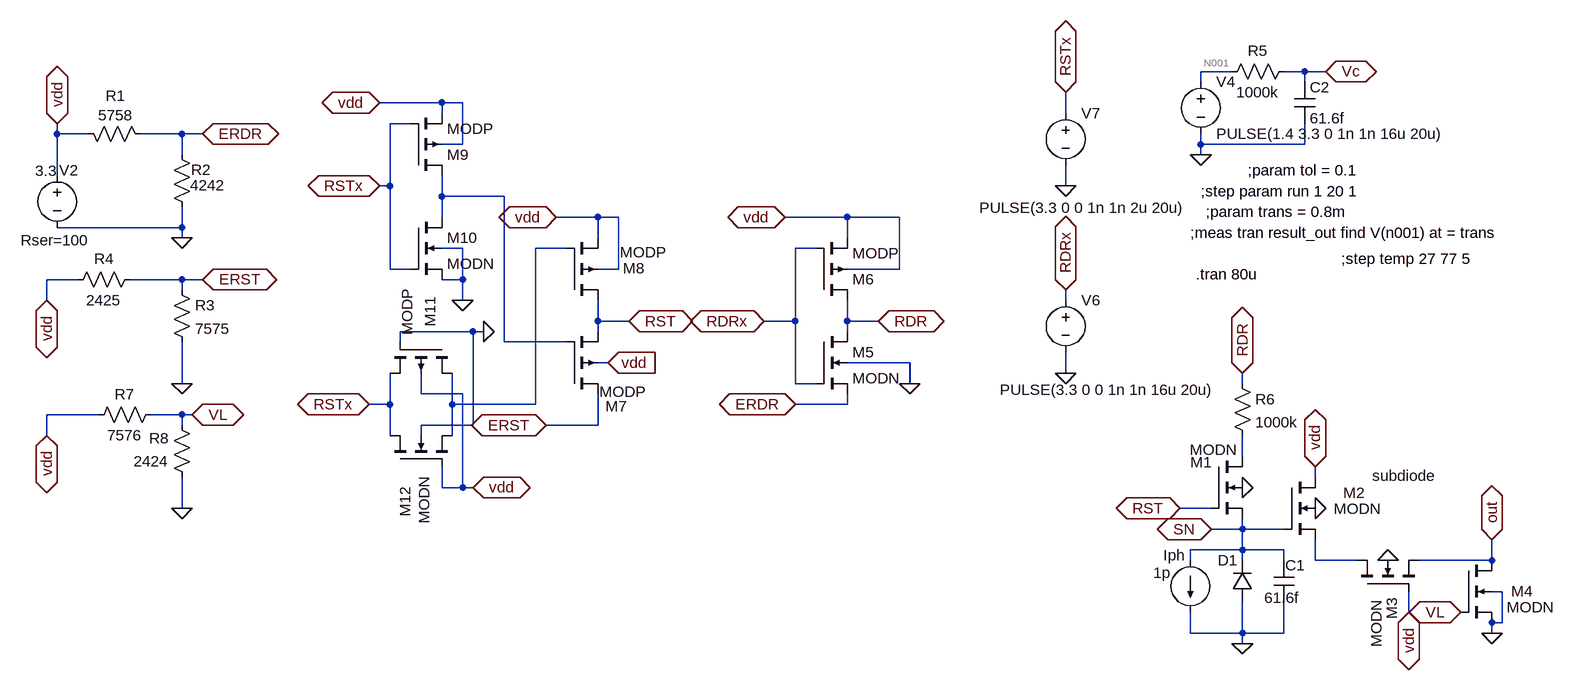
[diagram p0: schematic LIN LOG 2014 completo2 rdr mod R.asc]
LIN LOG 2014 completo2 rdr mod R.asc, the LTspice schematic file:
Version 4
SHEET 1 1836 840
WIRE 1328 -5088 1280 -5088
WIRE 1440 -5088 1408 -5088
WIRE 1472 -5088 1440 -5088
WIRE 1280 -5072 1280 -5088
WIRE 1440 -5072 1440 -5088
WIRE 112 -5040 16 -5040
WIRE 144 -5040 112 -5040
WIRE 112 -5024 112 -5040
WIRE 1072 -5024 1072 -5056
WIRE 64 -5008 32 -5008
WIRE -480 -4992 -480 -5008
WIRE -432 -4992 -480 -4992
WIRE -288 -4992 -352 -4992
WIRE -256 -4992 -288 -4992
WIRE 144 -4976 144 -5040
WIRE 144 -4976 112 -4976
WIRE 1280 -4976 1280 -4992
WIRE 1440 -4976 1440 -5008
WIRE 1440 -4976 1280 -4976
WIRE -288 -4960 -288 -4992
WIRE 1280 -4960 1280 -4976
WIRE -480 -4928 -480 -4992
WIRE 32 -4912 32 -5008
WIRE 32 -4912 16 -4912
WIRE 1072 -4912 1072 -4944
WIRE 112 -4896 112 -4928
WIRE 208 -4896 112 -4896
WIRE 112 -4864 112 -4896
WIRE 352 -4864 288 -4864
WIRE 384 -4864 352 -4864
WIRE 736 -4864 640 -4864
WIRE 816 -4864 736 -4864
WIRE -288 -4848 -288 -4880
WIRE -288 -4848 -480 -4848
WIRE -288 -4832 -288 -4848
WIRE 352 -4832 352 -4864
WIRE 736 -4832 736 -4864
WIRE 144 -4816 112 -4816
WIRE 304 -4816 256 -4816
WIRE 688 -4816 656 -4816
WIRE 32 -4784 32 -4912
WIRE 64 -4784 32 -4784
WIRE 384 -4784 384 -4864
WIRE 384 -4784 352 -4784
WIRE 816 -4784 816 -4864
WIRE 816 -4784 736 -4784
WIRE -448 -4768 -496 -4768
WIRE -288 -4768 -368 -4768
WIRE -256 -4768 -288 -4768
WIRE 144 -4768 144 -4816
WIRE 144 -4768 112 -4768
WIRE -288 -4752 -288 -4768
WIRE -496 -4736 -496 -4768
WIRE 144 -4736 144 -4768
WIRE 1072 -4736 1072 -4752
WIRE 352 -4704 352 -4736
WIRE 400 -4704 352 -4704
WIRE 656 -4704 656 -4816
WIRE 656 -4704 608 -4704
WIRE 736 -4704 736 -4736
WIRE 784 -4704 736 -4704
WIRE 160 -4688 48 -4688
WIRE 176 -4688 160 -4688
WIRE 352 -4688 352 -4704
WIRE 736 -4688 736 -4704
WIRE 48 -4672 48 -4688
WIRE 208 -4672 208 -4896
WIRE 304 -4672 208 -4672
WIRE 368 -4640 352 -4640
WIRE 832 -4640 736 -4640
WIRE 1072 -4624 1072 -4656
WIRE -288 -4608 -288 -4672
WIRE 656 -4608 656 -4704
WIRE 688 -4608 656 -4608
WIRE 832 -4608 832 -4640
WIRE 1344 -4608 1344 -4624
WIRE 80 -4592 80 -4624
WIRE 144 -4592 80 -4592
WIRE 32 -4576 32 -4624
WIRE 32 -4576 0 -4576
WIRE 128 -4576 128 -4624
WIRE 256 -4576 256 -4816
WIRE 256 -4576 128 -4576
WIRE 736 -4576 736 -4592
WIRE 736 -4576 656 -4576
WIRE -416 -4560 -496 -4560
WIRE -288 -4560 -336 -4560
WIRE -272 -4560 -288 -4560
WIRE -288 -4544 -288 -4560
WIRE 160 -4544 160 -4688
WIRE 160 -4544 80 -4544
WIRE 352 -4544 352 -4592
WIRE 352 -4544 272 -4544
WIRE -496 -4528 -496 -4560
WIRE 32 -4528 32 -4576
WIRE 80 -4528 80 -4544
WIRE 128 -4528 128 -4576
WIRE 1344 -4496 1344 -4528
WIRE 1456 -4464 1456 -4480
WIRE 112 -4448 112 -4480
WIRE 144 -4448 144 -4592
WIRE 144 -4448 112 -4448
WIRE 160 -4448 144 -4448
WIRE -288 -4416 -288 -4464
WIRE 1296 -4416 1248 -4416
WIRE 1344 -4384 1344 -4400
WIRE 1344 -4384 1296 -4384
WIRE 1408 -4384 1344 -4384
WIRE 1344 -4352 1344 -4384
WIRE 1344 -4352 1264 -4352
WIRE 1408 -4352 1344 -4352
WIRE 1264 -4336 1264 -4352
WIRE 1344 -4336 1344 -4352
WIRE 1408 -4336 1408 -4352
WIRE 1456 -4336 1456 -4368
WIRE 1520 -4336 1456 -4336
WIRE 1728 -4336 1728 -4368
WIRE 1728 -4336 1616 -4336
WIRE 1536 -4320 1536 -4336
WIRE 1744 -4288 1728 -4288
WIRE 1600 -4256 1600 -4288
WIRE 1728 -4240 1728 -4256
WIRE 1744 -4240 1744 -4288
WIRE 1744 -4240 1728 -4240
WIRE 1264 -4224 1264 -4256
WIRE 1344 -4224 1344 -4272
WIRE 1344 -4224 1264 -4224
WIRE 1408 -4224 1408 -4272
WIRE 1408 -4224 1344 -4224
WIRE 1728 -4224 1728 -4240
WIRE 1344 -4208 1344 -4224
FLAG 1248 -4416 RST
IOPIN 1248 -4416 BiDir
FLAG -288 -4832 0
FLAG 1344 -4448 0
FLAG 1344 -4208 0
FLAG 1344 -4624 RDR
IOPIN 1344 -4624 BiDir
FLAG 1456 -4416 0
FLAG 1728 -4224 0
FLAG 1680 -4256 VL
IOPIN 1680 -4256 BiDir
FLAG 1456 -4480 vdd
IOPIN 1456 -4480 BiDir
FLAG 1568 -4336 0
FLAG 1600 -4256 vdd
IOPIN 1600 -4256 BiDir
FLAG 1728 -4368 out
IOPIN 1728 -4368 BiDir
FLAG 1296 -4384 SN
IOPIN 1296 -4384 BiDir
FLAG -256 -4992 ERDR
IOPIN -256 -4992 BiDir
FLAG 640 -4864 vdd
IOPIN 640 -4864 BiDir
FLAG 832 -4608 0
FLAG 784 -4704 RDR
IOPIN 784 -4704 BiDir
FLAG 608 -4704 RDRx
IOPIN 608 -4704 BiDir
FLAG 656 -4576 ERDR
IOPIN 656 -4576 BiDir
FLAG 1072 -4624 0
FLAG 1072 -4752 RDRx
IOPIN 1072 -4752 BiDir
FLAG 288 -4864 vdd
IOPIN 288 -4864 BiDir
FLAG 400 -4704 RST
IOPIN 400 -4704 BiDir
FLAG 368 -4640 vdd
IOPIN 368 -4640 In
FLAG 272 -4544 ERST
IOPIN 272 -4544 BiDir
FLAG 16 -5040 vdd
IOPIN 16 -5040 BiDir
FLAG 16 -4912 RSTx
IOPIN 16 -4912 BiDir
FLAG 144 -4736 0
FLAG 160 -4448 vdd
IOPIN 160 -4448 BiDir
FLAG 176 -4688 0
FLAG 0 -4576 RSTx
IOPIN 0 -4576 BiDir
FLAG 1072 -5056 RSTx
IOPIN 1072 -5056 BiDir
FLAG 1072 -4912 0
FLAG -288 -4608 0
FLAG -256 -4768 ERST
IOPIN -256 -4768 BiDir
FLAG 1472 -5088 Vc
IOPIN 1472 -5088 BiDir
FLAG 1280 -4960 0
FLAG -496 -4736 vdd
IOPIN -496 -4736 BiDir
FLAG -288 -4416 0
FLAG -496 -4528 vdd
IOPIN -496 -4528 BiDir
FLAG -272 -4560 VL
IOPIN -272 -4560 BiDir
FLAG -480 -5008 vdd
IOPIN -480 -5008 BiDir
SYMBOL voltage -480 -4944 R0
WINDOW 123 0 0 Left 2
WINDOW 39 -56 116 Left 2
WINDOW 0 3 8 Left 2
WINDOW 3 -34 9 Left 2
SYMATTR SpiceLine Rser=100
SYMATTR InstName V2
SYMATTR Value 3.3
SYMBOL nmos4 1296 -4496 R0
WINDOW 0 -32 9 Left 2
WINDOW 3 -33 -10 Left 2
SYMATTR InstName M1
SYMATTR Value MODN
SYMATTR Value2 l=0.35u w=0.70u
SYMBOL nmos4 1408 -4464 R0
WINDOW 3 77 49 Left 2
WINDOW 0 91 24 Left 2
SYMATTR Value MODN
SYMATTR InstName M2
SYMATTR Value2 l=0.35u w=0.70u
SYMBOL nmos4 1680 -4336 R0
WINDOW 0 78 48 Left 2
WINDOW 3 71 72 Left 2
SYMATTR InstName M4
SYMATTR Value MODN
SYMATTR Value2 l=0.35u w=0.70u
SYMBOL diode 1360 -4272 R180
WINDOW 0 23 64 Left 2
WINDOW 3 -282 194 Left 2
SYMATTR InstName D1
SYMATTR Value subdiode
SYMBOL current 1264 -4336 R0
WINDOW 3 -57 19 Left 2
WINDOW 123 0 0 Left 2
WINDOW 39 0 0 Left 2
WINDOW 0 -42 -8 Left 2
SYMATTR Value 1p
SYMATTR InstName Iph
SYMBOL nmos4 1520 -4288 R270
WINDOW 0 -43 54 Left 2
WINDOW 3 -86 30 Left 2
SYMATTR InstName M3
SYMATTR Value MODN
SYMATTR Value2 l=0.35u w=0.70u
SYMBOL res -448 -5008 M90
WINDOW 0 -27 58 VBottom 2
WINDOW 3 -28 58 VTop 2
SYMATTR InstName R1
SYMATTR Value 5758
SYMBOL res -272 -4864 R180
WINDOW 0 -29 73 Left 2
WINDOW 3 -51 49 Left 2
SYMATTR InstName R2
SYMATTR Value 4242
SYMBOL nmos4 688 -4688 R0
SYMATTR InstName M5
SYMATTR Value MODN
SYMATTR Value2 l=0.35u w=0.70u
SYMBOL pmos4 688 -4736 M180
SYMATTR InstName M6
SYMATTR Value MODP
SYMATTR Value2 l=0.35u w=0.70u
SYMBOL voltage 1072 -4752 R0
WINDOW 3 -101 154 Left 2
WINDOW 123 0 0 Left 2
WINDOW 39 0 0 Left 2
SYMATTR Value PULSE(3.3 0 0 1n 1n 16u 20u)
SYMATTR InstName V6
SYMBOL pmos4 304 -4592 M180
WINDOW 0 60 -19 Left 2
WINDOW 3 51 3 Left 2
SYMATTR InstName M7
SYMATTR Value MODP
SYMATTR Value2 l=0.35u w=0.70u
SYMBOL pmos4 304 -4736 M180
WINDOW 0 87 49 Left 2
WINDOW 3 82 74 Left 2
SYMATTR InstName M8
SYMATTR Value MODP
SYMATTR Value2 l=0.35u w=0.70u
SYMBOL pmos4 64 -4928 M180
SYMATTR InstName M9
SYMATTR Value MODP
SYMATTR Value2 l=0.35u w=0.70u
SYMBOL nmos4 64 -4864 R0
SYMATTR InstName M10
SYMATTR Value MODN
SYMATTR Value2 l=0.35u w=0.70u
SYMBOL pmos4 128 -4672 R90
WINDOW 0 -70 34 Left 2
WINDOW 3 -82 69 Left 2
SYMATTR InstName M11
SYMATTR Value MODP
SYMATTR Value2 l=0.35u w=0.70u
SYMBOL nmos4 32 -4480 R270
WINDOW 0 -77 24 Left 2
WINDOW 3 -88 53 Left 2
SYMATTR InstName M12
SYMATTR Value MODN
SYMATTR Value2 l=0.35u w=0.70u
SYMBOL voltage 1072 -5040 R0
WINDOW 3 -133 162 Left 2
WINDOW 123 0 0 Left 2
WINDOW 39 0 0 Left 2
SYMATTR Value PULSE(3.3 0 0 1n 1n 2u 20u)
SYMATTR InstName V7
SYMBOL res -304 -4768 R0
SYMATTR InstName R3
SYMATTR Value 7575
SYMBOL res -352 -4784 R90
WINDOW 0 0 56 VBottom 2
WINDOW 3 32 56 VTop 2
SYMATTR InstName R4
SYMATTR Value 2425
SYMBOL cap 1392 -4336 R0
WINDOW 3 -14 58 Left 2
WINDOW 0 18 8 Left 2
SYMATTR Value 61.6f
SYMATTR InstName C1
SYMBOL res 1424 -5104 R90
WINDOW 0 0 56 VBottom 2
WINDOW 3 32 56 VTop 2
SYMATTR InstName R5
SYMATTR Value 1000k
SYMBOL cap 1424 -5072 R0
SYMATTR InstName C2
SYMATTR Value 61.6f
SYMBOL voltage 1280 -5088 R0
WINDOW 123 0 0 Left 2
WINDOW 39 0 0 Left 2
SYMATTR InstName V4
SYMATTR Value PULSE(1.4 3.3 0 1n 1n 16u 20u)
SYMBOL res -320 -4576 R90
WINDOW 0 0 56 VBottom 2
WINDOW 3 32 56 VTop 2
SYMATTR InstName R7
SYMATTR Value 7576
SYMBOL res -272 -4448 R180
WINDOW 0 36 76 Left 2
WINDOW 3 36 40 Left 2
SYMATTR InstName R8
SYMATTR Value 2424
SYMBOL res 1328 -4624 R0
SYMATTR InstName R6
SYMATTR Value 1000k
TEXT 1272 -4776 Left 2 !.tran 80u
TEXT 1352 -4936 Left 2 !;param tol = 0.1
TEXT 1280 -4904 Left 2 !;step param run 1 20 1
TEXT 1288 -4872 Left 2 !;param trans = 0.8m
TEXT 1264 -4840 Left 2 !;meas tran result_out find V(n001) at = trans
TEXT 1496 -4800 Left 2 !;step temp 27 77 5

The netlist it stands for:
* LIN LOG 2014 completo2 rdr mod R.asc
V2 vdd 0 3.3 Rser=100
M1 N004 RST SN 0 MODN l=0.35u w=0.70u
M2 vdd SN N005 0 MODN l=0.35u w=0.70u
M4 out VL 0 0 MODN l=0.35u w=0.70u
D1 0 SN subdiode
Iph SN 0 1p
M3 N005 vdd out 0 MODN l=0.35u w=0.70u
R1 vdd ERDR 5758
R2 0 ERDR 4242
M5 RDR RDRx ERDR 0 MODN l=0.35u w=0.70u
M6 RDR RDRx vdd vdd MODP l=0.35u w=0.70u
V6 RDRx 0 PULSE(3.3 0 0 1n 1n 16u 20u)
M7 ERST N002 RST vdd MODP l=0.35u w=0.70u
M8 RST N003 vdd vdd MODP l=0.35u w=0.70u
M9 N002 RSTx vdd vdd MODP l=0.35u w=0.70u
M10 N002 RSTx 0 0 MODN l=0.35u w=0.70u
M11 N003 0 RSTx vdd MODP l=0.35u w=0.70u
M12 RSTx vdd N003 0 MODN l=0.35u w=0.70u
V7 RSTx 0 PULSE(3.3 0 0 1n 1n 2u 20u)
R3 ERST 0 7575
R4 ERST vdd 2425
C1 SN 0 61.6f
R5 Vc N001 1000k
C2 Vc 0 61.6f
V4 N001 0 PULSE(1.4 3.3 0 1n 1n 16u 20u)
R7 VL vdd 7576
R8 0 VL 2424
R6 RDR N004 1000k
.model D D
.lib standard.dio
.model NMOS NMOS
.model PMOS PMOS
.lib standard.mos
.tran 80u
;param tol = 0.1
;step param run 1 20 1
;param trans = 0.8m
;meas tran result_out find V(n001) at = trans
;step temp 27 77 5
.backanno
.end